# Altium schematic sheet RF.SchDoc: RF
size A3; Author: Tomás Valencia; DrawnBy: Tomás Valencia; DocumentNumber: 4; SheetNumber: 4; SheetTotal: 6
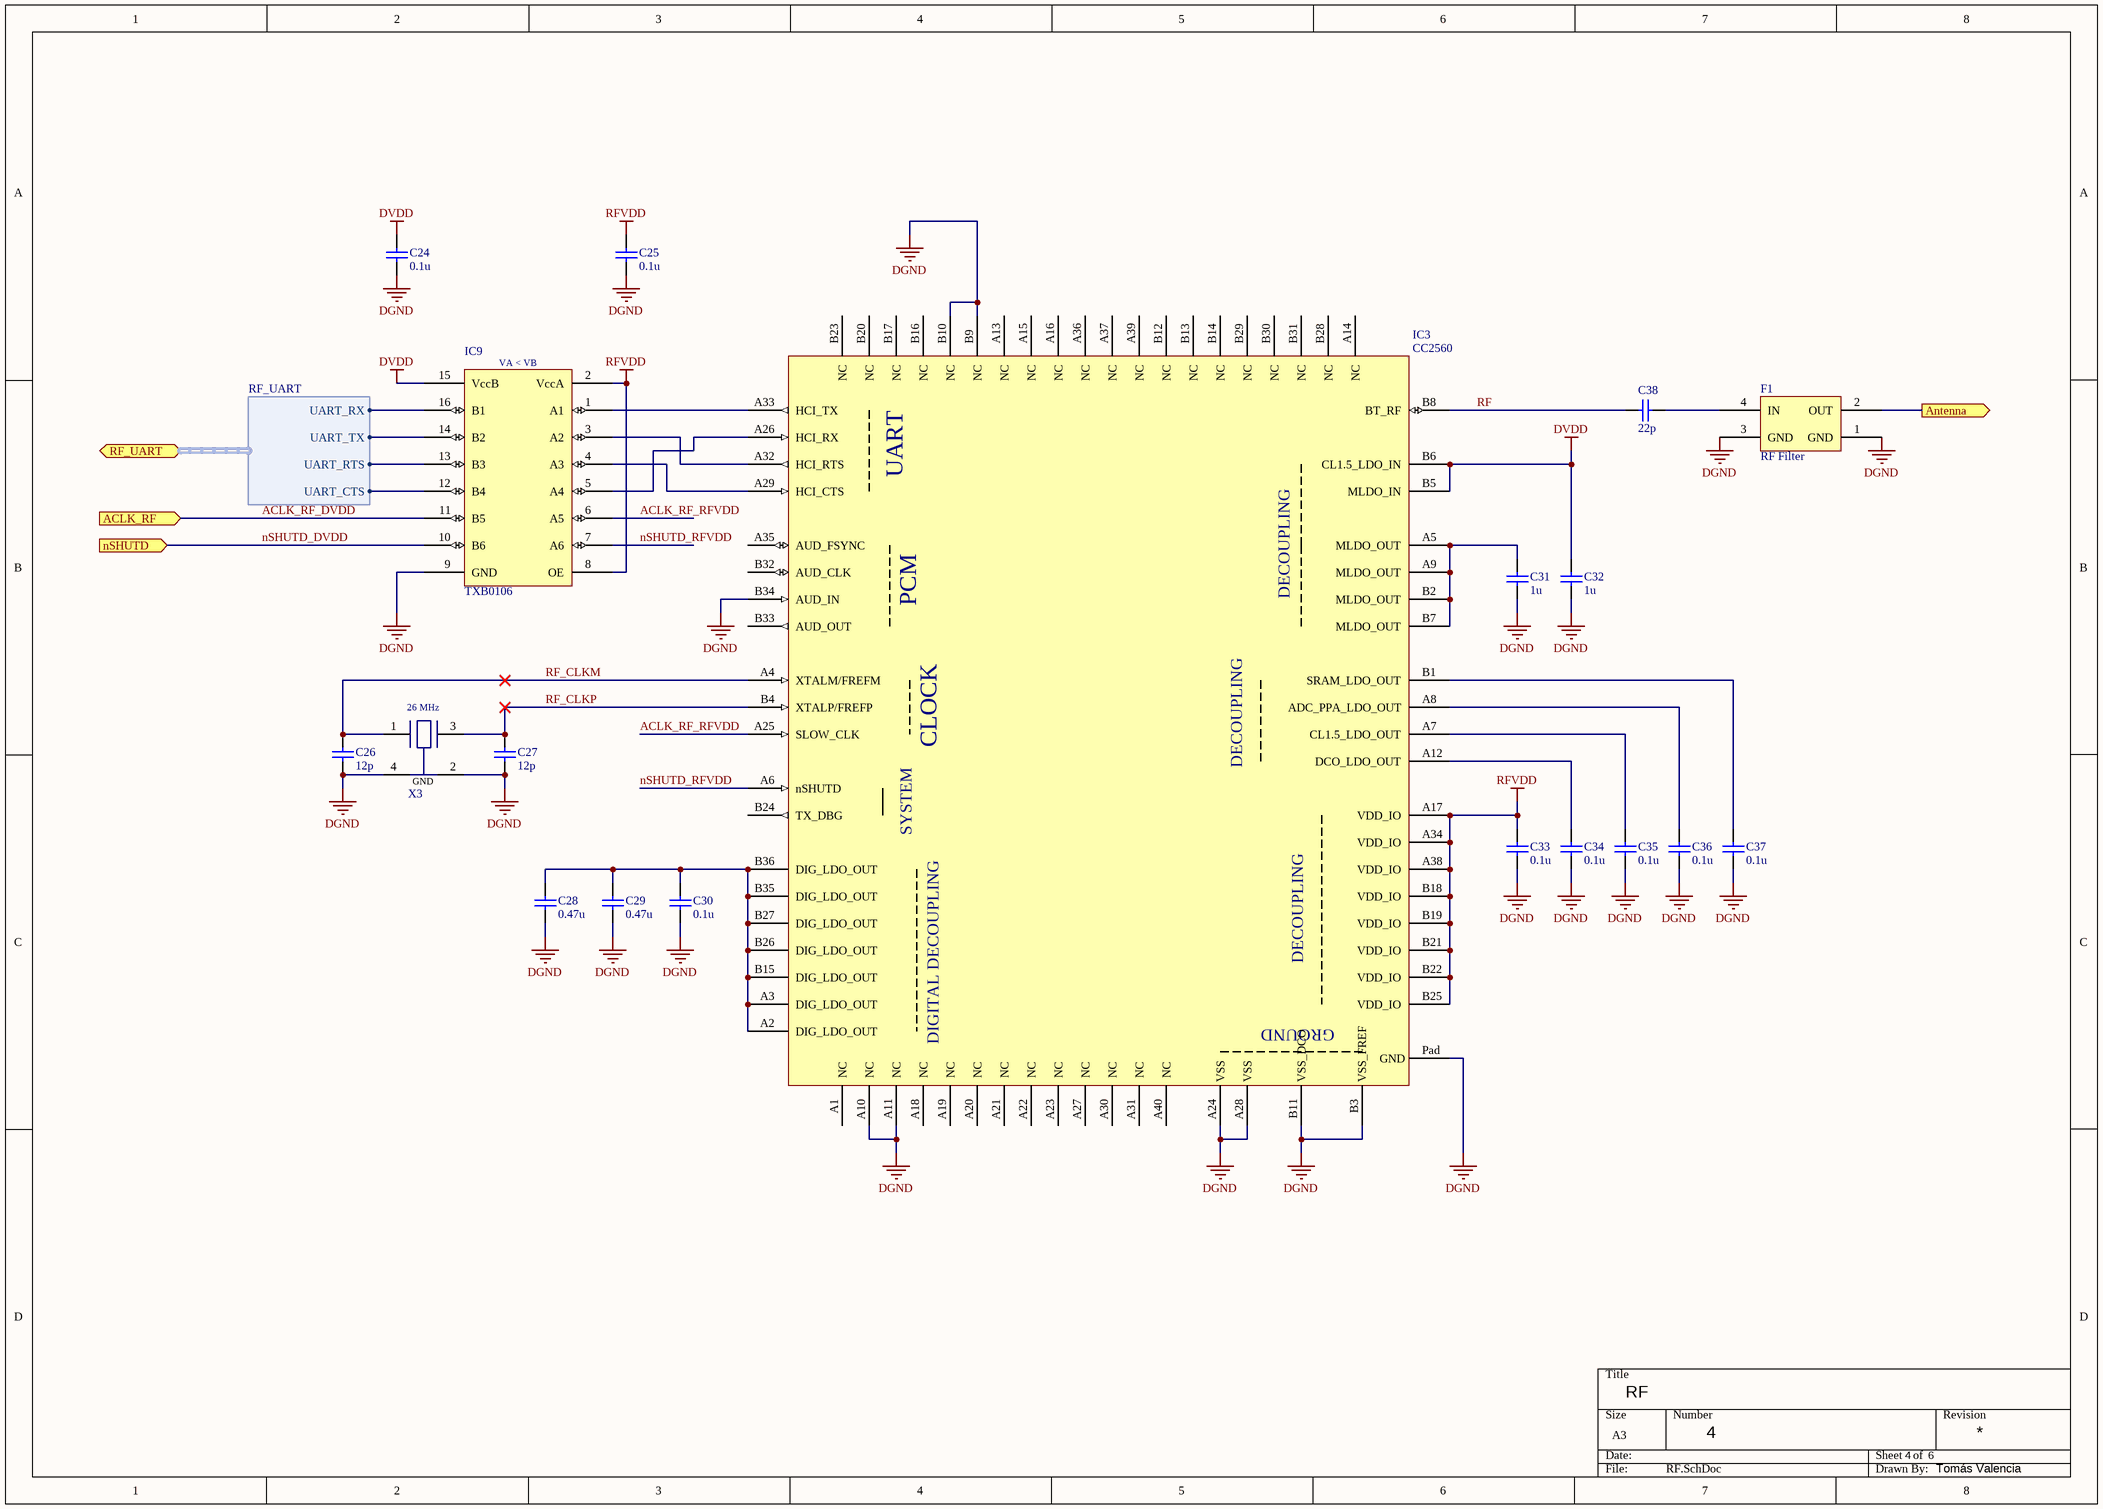
[diagram p0: RF.SchDoc]

## Parts
C24  0.1u  [C0603]
C25  0.1u  [C0603]
C26  12p  [C0603]
C27  12p  [C0603]
C28  0.47u  [C0603]
C29  0.47u  [C0603]
C30  0.1u  [C0603]
C31  1u  [C0603]
C32  1u  [C0603]
C33  0.1u  [C0603]
C34  0.1u  [C0603]
C35  0.1u  [C0603]
C36  0.1u  [C0603]
C37  0.1u  [C0603]
C38  22p  [C0603]
F1  RF Filter  [LFB212G45SG8A127]
IC3  CC2560  [CC2560]
IC9  TXB0106  [TXB0106]
X3  XTAL_26_MHz  [XTAL_26MHZ]  (value not drawn)

## Ports
ACLK_RF (in), Antenna (out), nSHUTD (in), RF_UART (harness RF_UART)

## Harnesses
RF_UART: UART_TX, UART_RX, UART_RTS, UART_CTS

## Nets
DGND: C24.1 C25.1 C26.1 C27.1 C28.1 C29.1 C30.1 C31.1 C32.1 C33.1 C34.1 C35.1 C36.1 C37.1 F1.1(GND) F1.3(GND) IC3.A10(NC) IC3.A11(NC) IC3.A24(VSS) IC3.A28(VSS) IC3.B3(VSS_FREF) IC3.B9(NC) IC3.B10(NC) IC3.B11(VSS_DCO) IC3.B34(AUD_IN) IC3.Pad(GND) IC9.9(GND) X3.2(GND) X3.4(GND)
DVDD: C24.2 C32.2 IC3.B5(MLDO_IN) IC3.B6(CL1.5_LDO_IN) IC9.15(VccB)
RFVDD: C25.2 C33.2 IC3.A17(VDD_IO) IC3.A34(VDD_IO) IC3.A38(VDD_IO) IC3.B18(VDD_IO) IC3.B19(VDD_IO) IC3.B21(VDD_IO) IC3.B22(VDD_IO) IC3.B25(VDD_IO) IC9.2(VccA) IC9.8(OE)
ACLK_RF_DVDD: IC9.11(B5) ; port ACLK_RF
ACLK_RF_RFVDD: IC3.A25(SLOW_CLK) IC9.6(A5)
Antenna: F1.2(OUT) ; port Antenna
nSHUTD_DVDD: IC9.10(B6) ; port nSHUTD
nSHUTD_RFVDD: IC3.A6(nSHUTD) IC9.7(A6)
RF: C38.1 IC3.B8(BT_RF)
RF_CLKM: C26.2 IC3.A4(XTALM/FREFM) X3.1(OUT)
RF_CLKP: C27.2 IC3.B4(XTALP/FREFP) X3.3(IN)
NetC28_2: C28.2 C29.2 C30.2 IC3.A2(DIG_LDO_OUT) IC3.A3(DIG_LDO_OUT) IC3.B15(DIG_LDO_OUT) IC3.B26(DIG_LDO_OUT) IC3.B27(DIG_LDO_OUT) IC3.B35(DIG_LDO_OUT) IC3.B36(DIG_LDO_OUT)
NetC31_2: C31.2 IC3.A5(MLDO_OUT) IC3.A9(MLDO_OUT) IC3.B2(MLDO_OUT) IC3.B7(MLDO_OUT)
NetC34_2: C34.2 IC3.A12(DCO_LDO_OUT)
NetC35_2: C35.2 IC3.A7(CL1.5_LDO_OUT)
NetC36_2: C36.2 IC3.A8(ADC_PPA_LDO_OUT)
NetC37_2: C37.2 IC3.B1(SRAM_LDO_OUT)
NetC38_2: C38.2 F1.4(IN)
NetIC3_A26: IC3.A26(HCI_RX) IC9.5(A4)
NetIC3_A29: IC3.A29(HCI_CTS) IC9.4(A3)
NetIC3_A32: IC3.A32(HCI_RTS) IC9.3(A2)
NetIC3_A33: IC3.A33(HCI_TX) IC9.1(A1)
NetIC9_12: IC9.12(B4) ; port RF_UART.UART_CTS
NetIC9_13: IC9.13(B3) ; port RF_UART.UART_RTS
NetIC9_14: IC9.14(B2) ; port RF_UART.UART_TX
NetIC9_16: IC9.16(B1) ; port RF_UART.UART_RX

Not connected (* = marked no-connect by the designer): IC3 A1(NC) A13(NC) A14(NC) A15(NC) A16(NC) A18(NC) A19(NC) A20(NC) A21(NC) A22(NC) A23(NC) A27(NC) A30(NC) A31(NC) A35(AUD_FSYNC) A36(NC) A37(NC) A39(NC) A40(NC) B12(NC) B13(NC) B14(NC) B16(NC) B17(NC) B20(NC) B23(NC) B24(TX_DBG) B28(NC) B29(NC) B30(NC) B31(NC) B32(AUD_CLK) B33(AUD_OUT)

## Notes on the sheet
- (in symbol CC2560) UART; DECOUPLING; PCM; CLOCK; SYSTEM; GROUND; DIGITAL DECOUPLING
- (in symbol TXB0106) VA < VB
- (in symbol XTAL_26_MHz) 26 MHz

## Library data of the parts
C24-C38 = Capacitor: Rated Voltage: *
  C24 C25 C30 C33-C37: Value: 0.1u
  C26 C27: Value: 12p
  C28 C29: Value: 0.47u
  C31 C32: Value: 1u
  C38: Value: 22p
F1 = LFB212G45SG8A127: RF Filter 2.4 GHz